# EAGLE schematic raspi3_nonHatv3 (EAGLE 9.4.1)
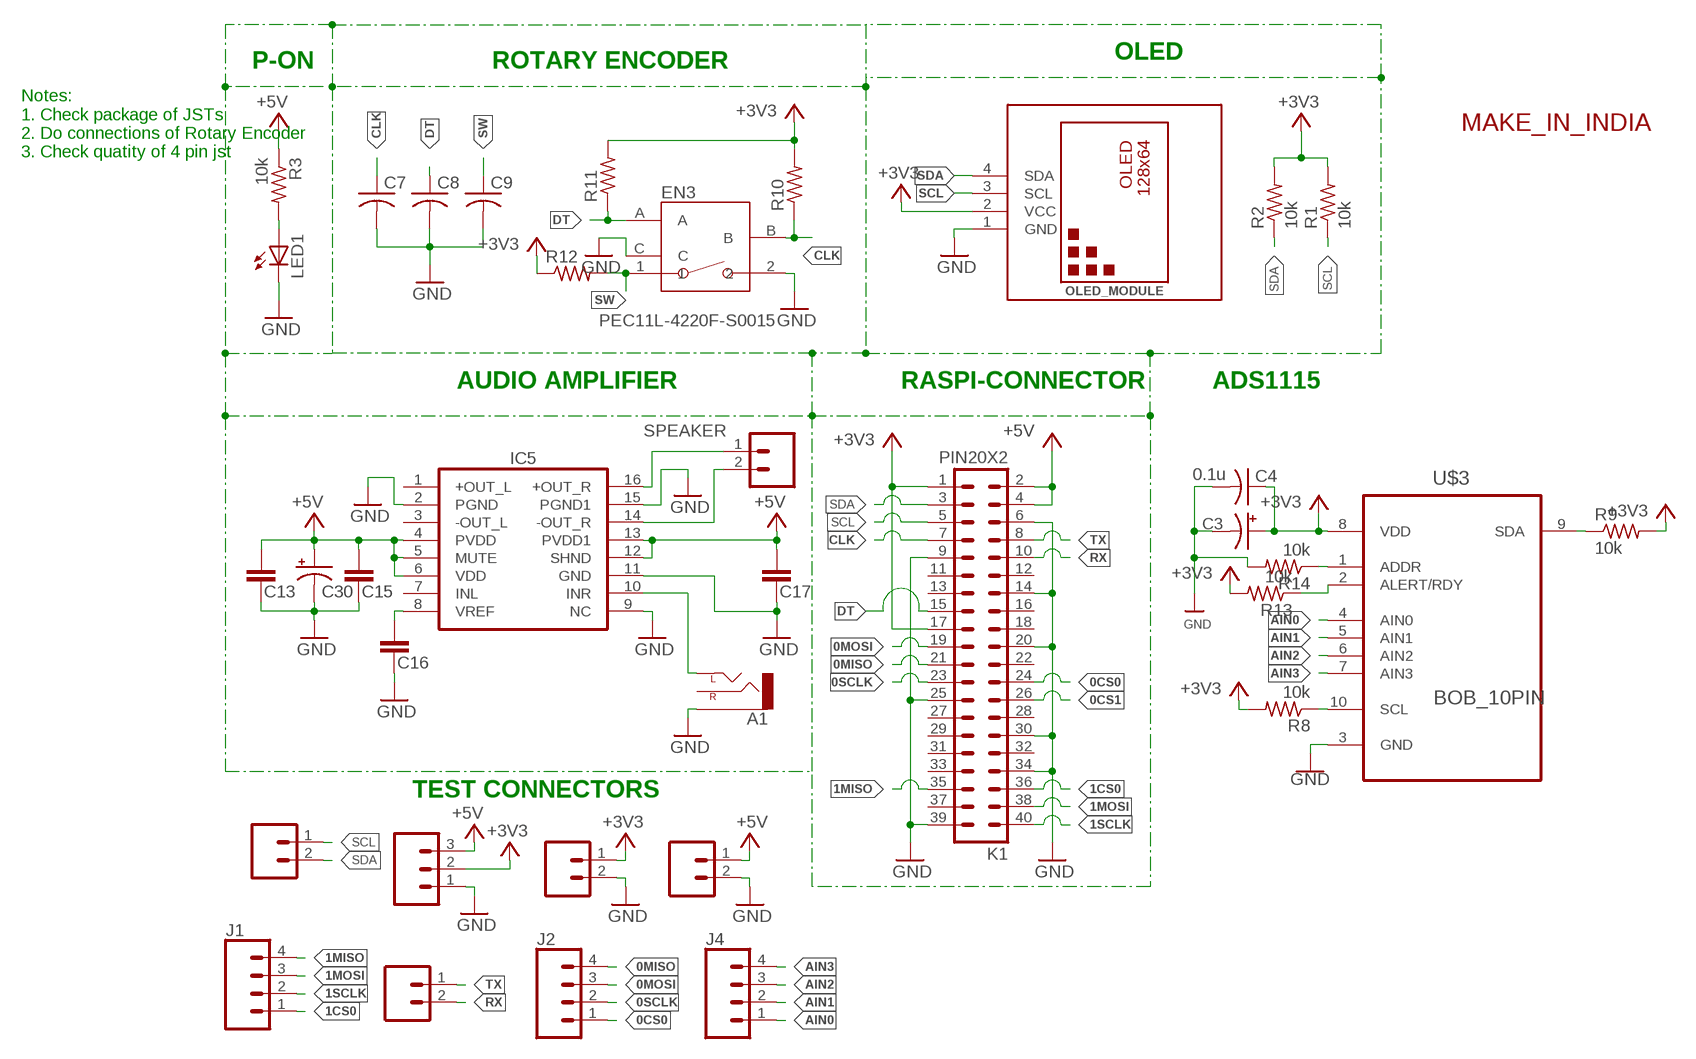
[diagram p0: schematic, sheet 1]

## Parts
A1  AUDIO-JACKPTH  [AUDIO-JACK]
C3  10u  CAP_POL_10V  [C/6032-28R]
C4  0.1u  CAP0805  [C0805]
C7  C-USC0603K  [C0603K]
C8  C-USC0603K  [C0603K]
C9  C-USC0603K  [C0603K]
C13  1uf  C-EUC1206  [C1206]
C15  1uf  C-EUC1206  [C1206]
C16  0.1uf  C-EUC1206  [C1206]
C17  1uf  C-EUC1206  [C1206]
C30  CAP_POL_10V  [C/6032-28R]
EN3  PEC11L-4220F-S0015  [PEC11L-4220F-S0015]
IC5  PAM8403  [SOP-16]
J1  CONN_04POLAR  [MOLEX-1X4]
J2  CONN_04POLAR  [MOLEX-1X4]
J4  CONN_04POLAR  [MOLEX-1X4]
K1  PIN20X2  [PIN_20X2]
LED1  LED3MM  [LED3MM]
OLED_MODULE  DIY-MODULES_DISPLAY-OLED-128X64-I2C  [DIY-MODULES_DISPLAY-OLED-128X64-I2C]
POWER  CONN_03POLAR  [MOLEX-1X3]
R1  10k  RESISTOR0207/7  [0207/7]
R2  10k  RESISTOR0207/7  [0207/7]
R3  10k  RESISTOR0207/7  [0207/7]
R8  10k  RESISTOR0603  [R0603]
R9  10k  RESISTOR0603  [R0603]
R10  R-US_M0805  [M0805]
R11  R-US_M0805  [M0805]
R12  R-US_M0805  [M0805]
R13  10k  RESISTOR0603  [R0603]
R14  10k  RESISTOR0603  [R0603]
SPEAKER  M02  [02P]
THERMISTOR1  CONN_02POLAR  [MOLEX-1X2]
THERMISTOR2  CONN_02POLAR  [MOLEX-1X2]
THERMISTOR3  CONN_02POLAR  [MOLEX-1X2]
THERMISTOR4  CONN_02POLAR  [MOLEX-1X2]
U$1  MAKE-IN-INDIA-LOGO  [MAKE-IN-INDIA]
U$3  BOB_10PIN  [BOB10]

## Nets
0CS0: J2.1 K1.24
0CS1: K1.26
0MISO: J2.4 K1.21
0MOSI: J2.3 K1.19
0SCLK: J2.2 K1.23
1CS0: J1.1 K1.36
1MISO: J1.4 K1.35
1MOSI: J1.3 K1.38
1SCLK: J1.2 K1.40
+3V3: C3.+ C4.1 K1.1 K1.17 OLED_MODULE.2(VCC) POWER.2 R1.2 R2.2 R8.2 R9.2 R10.2 R11.2 R12.1 R13.2 THERMISTOR2.1 U$3.8(VDD)
+5V: C13.1 C15.2 C17.2 C30.+ IC5.4(PVDD) IC5.5(MUTE) IC5.6(VDD) IC5.12(SHND) IC5.13(PVDD1) K1.2 K1.4 POWER.3 R3.1 THERMISTOR3.1
AIN0: J4.1 U$3.4(AIN0)
AIN1: J4.2 U$3.5(AIN1)
AIN2: J4.3 U$3.6(AIN2)
AIN3: J4.4 U$3.7(AIN3)
CLK: C7.1 EN3.B K1.7 R10.1
DT: C8.1 EN3.A K1.15 R11.1
GND: A1.SLEEVE C3.- C4.2 C7.2 C8.2 C9.2 C13.2 C15.1 C16.2 C17.1 C30.- EN3.2 EN3.C IC5.2(PGND) IC5.9(NC) IC5.11(GND) IC5.15(PGND1) K1.6 K1.9 K1.14 K1.20 K1.25 K1.30 K1.34 K1.39 LED1.K(C) OLED_MODULE.1(GND) POWER.1 R14.2 THERMISTOR2.2 THERMISTOR3.2 U$3.3(GND)
N$1: LED1.A R3.2
N$4: IC5.16(+OUT_R) SPEAKER.1
N$12: R8.1 U$3.10(SCL)
N$13: R9.1 U$3.9(SDA)
N$14: R13.1 U$3.2(ALERT/RDY)
N$15: R14.1 U$3.1(ADDR)
N$27: IC5.14(-OUT_R) SPEAKER.2
N$29: A1.TIP(LEFT) IC5.10(INR)
N$34: C16.1 IC5.8(VREF)
RX: K1.10 THERMISTOR4.2
SCL: K1.5 OLED_MODULE.3(SCL) R1.1 THERMISTOR1.1
SDA: K1.3 OLED_MODULE.4(SDA) R2.1 THERMISTOR1.2
SW: C9.1 EN3.1 R12.2
TX: K1.8 THERMISTOR4.1
Unconnected: A1.RING(RIGHT) IC5.1(+OUT_L) IC5.3(-OUT_L) IC5.7(INL) K1.11 K1.12 K1.13 K1.16 K1.18 K1.22 K1.27 K1.28 K1.29 K1.31 K1.32 K1.33 K1.37

## Notes on the sheet
- OLED
- P-ON | ROTARY ENCODER
- Notes:
  1. Check package of JSTs
  2. Do connections of Rotary Encoder
  3. Check quatity of 4 pin jst
- AUDIO AMPLIFIER | RASPI-CONNECTOR | ADS1115
- TEST CONNECTORS

## Library data of the parts
A1 = CEDT_JANUARY_2015_v5:AUDIO-JACK: 3.5mm Audio Jack Simple 3.5mm common PCB mount audio jack. SKU: PRT-08032
C3 = CEDT_JANUARY_2015_v5:CAP_POL
C4 = CEDT_JANUARY_2015_v5:CAP
C7-C9 = adafruit:C-US: CAPACITOR, American symbol
C13 C15-C17 = rcl:C-EU: CAPACITOR, European symbol
C30 = CEDT_SEPTEMBER_V2:CAP_POL
EN3 = Encoders:PEC11L-4220F-S0015: ROTARY ENCODER MECHANICAL 15PPR Manufacturer's datasheet <https://www.bourns.com/docs/Product-Datasheets/PEC11L.pdf>; CREATED_BY: PCBLayout.com; DIGIKEY_PARTNO: PEC11L-4220F-S0015-ND; MANUFACTURER: Bourns Inc.; MPN: PEC11L-4220F-S0015
IC5 = PAM8403:PAM8403: Dual channel audio amplifier IC - PAM8403
J1 J2 J4 = SparkFun-Connectors:CONN_04: Multi connection point. Often used as Generic Header-pin footprint for 0.1 inch spaced/style header connections On any of the 0.1 inch spaced packages, you can populate with these: Break Away Headers - Straight <https://www.sparkfun.com/products/116> (PRT-00116) Break Away Male Headers - Right Angle <https://www.sparkfun.com/products/553> (PRT-00553) Female Headers <https://www.sparkfun.com/products/115> (PRT-00115) Break Away Headers - Machine Pin <https://www.sparkfun.com/products/117> (PRT-00117) Break Away Female Headers - Swiss Machine Pin <https://www.sparkfun.com/products/743> (PRT-00743) For SCREWTERMINALS and SPRING TERMINALS visit here: Screw Terimnals on SparkFun.com <https://www.sparkfun.com/search/results?term=Screw+Terminals> (5mm/3.5mm/2.54mm spacing) This device is also useful as a general connection point to wire up your design to another part of your project. Our various solder wires solder well into these plated through hole pads. Hook-Up Wire - Assortment (Stranded, 22 AWG) <https://www.sparkfun.com/products/11375> (PRT-11375) Hook-Up Wire - Assortment (Solid Core, 22 AWG) <https://www.sparkfun.com/products/11367> (PRT-11367) View the entire wire category on our website here <https://www.sparkfun.com/categories/141> Special notes: Molex polarized connector foot print use with SKU : PRT-08231 with associated crimp pins and housings. 1MM SMD Version SKU: PRT-10208; PROD_ID: CONN-08186; SF_ID: PRT-08231
K1 = FLYFISH:PIN20X2
LED1 = CEDT_JANUARY_2015_v5:LED
OLED_MODULE = esp32_dev_kit_v14:DIY-MODULES_DISPLAY-OLED-128X64-I2C: 128x64 Dot Matrix OLED Module based on SSD1306 chip Variant with I2C interface More details available here: http://www.instructables.com/id/Monochrome-096-i2c-OLED-display-with-arduino-SSD13/ SSD1306 datasheet: https://cdn-shop.adafruit.com/datasheets/SSD1306.pdf Click here to find device on ebay.com <http://www.ebay.com/sch/oled+display+128x64+iic> Note: There are two variants: I2C and SPI. Search for the proper version.
POWER = SparkFun-Connectors:CONN_03: Multi connection point. Often used as Generic Header-pin footprint for 0.1 inch spaced/style header connections On any of the 0.1 inch spaced packages, you can populate with these: Break Away Headers - Straight <https://www.sparkfun.com/products/116> (PRT-00116) Break Away Male Headers - Right Angle <https://www.sparkfun.com/products/553> (PRT-00553) Female Headers <https://www.sparkfun.com/products/115> (PRT-00115) Break Away Headers - Machine Pin <https://www.sparkfun.com/products/117> (PRT-00117) Break Away Female Headers - Swiss Machine Pin <https://www.sparkfun.com/products/743> (PRT-00743) Stackable Header - 3 Pin (Female, 0.1") <https://www.sparkfun.com/products/13875> (PRT-13875) For SCREWTERMINALS and SPRING TERMINALS visit here: Screw Terimnals on SparkFun.com <https://www.sparkfun.com/search/results?term=Screw+Terminals> (5mm/3.5mm/2.54mm spacing) This device is also useful as a general connection point to wire up your design to another part of your project. Our various solder wires solder well into these plated through hole pads. Hook-Up Wire - Assortment (Stranded, 22 AWG) <https://www.sparkfun.com/products/11375> (PRT-11375) Hook-Up Wire - Assortment (Solid Core, 22 AWG) <https://www.sparkfun.com/products/11367> (PRT-11367) View the entire wire category on our website here <https://www.sparkfun.com/categories/141> Special notes: Molex polarized connector foot print use with SKU : PRT-08232 with associated crimp pins and housings.; PROD_ID: CONN-08625; SF_ID: PRT-08096
R1-R3 = CEDT:RESISTOR; OC_FARNELL: unknown
R8 R9 R13 R14 = CEDT_JANUARY_2015_v5:RESISTOR
R10-R12 = rcl:R-US_: RESISTOR, American symbol; SPICEPREFIX: R
SPEAKER = CEDT_JANUARY_2015_v5:M02: AMP QUICK CONNECTOR
THERMISTOR1-THERMISTOR4 = SparkFun-Connectors:CONN_02: Multi connection point. Often used as Generic Header-pin footprint for 0.1 inch spaced/style header connections On any of the 0.1 inch spaced packages, you can populate with these: Break Away Headers - Straight <https://www.sparkfun.com/products/116> (PRT-00116) Break Away Male Headers - Right Angle <https://www.sparkfun.com/products/553> (PRT-00553) Female Headers <https://www.sparkfun.com/products/115> (PRT-00115) Break Away Headers - Machine Pin <https://www.sparkfun.com/products/117> (PRT-00117) Break Away Female Headers - Swiss Machine Pin <https://www.sparkfun.com/products/743> (PRT-00743) For SCREWTERMINALS and SPRING TERMINALS visit here: Screw Terimnals on SparkFun.com <https://www.sparkfun.com/search/results?term=Screw+Terminals> (5mm/3.5mm/2.54mm spacing) This device is also useful as a general connection point to wire up your design to another part of your project. Our various solder wires solder well into these plated through hole pads. Hook-Up Wire - Assortment (Stranded, 22 AWG) <https://www.sparkfun.com/products/11375> (PRT-11375) Hook-Up Wire - Assortment (Solid Core, 22 AWG) <https://www.sparkfun.com/products/11367> (PRT-11367) View the entire wire category on our website here <https://www.sparkfun.com/categories/141> Special notes: Molex polarized connector foot print use with: PRT-08233 with associated crimp pins and housings. 2.54_SCREWTERM for use with PRT-10571. 3.5mm Screw Terminal footprints for PRT-08084 5mm Screw Terminal footprints for use with PRT-08432; SF_ID: PRT-09918
U$1 = namanpuri:MAKE-IN-INDIA-LOGO
U$3 = CEDT_JANUARY_2015_v5:BOB_10PIN